# EAGLE design OpenHAS_SensorBoard_v1.0 (EAGLE 7.3.0)
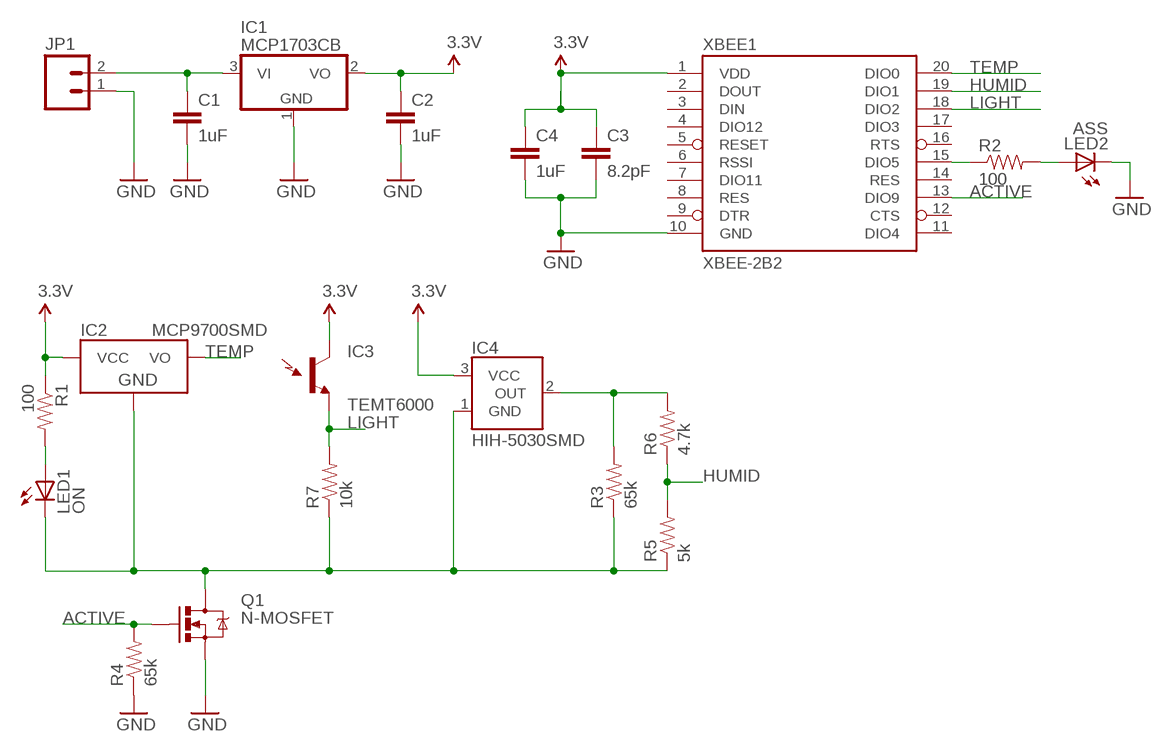
[diagram p0: schematic, sheet 1]

## Parts
C1  1uF  CAP0805  [0805]
C2  1uF  CAP0805  [0805]
C3  8.2pF  CAP0805  [0805]
C4  1uF  CAP0805  [0805]
IC1  MCP1703CB  [SOT23]
IC2  MCP9700SMD  [SOT23-3]
IC3  TEMT6000  LIGHTSENSORTEMT6000  [TEMT6000-SEN]
IC4  HIH-5030SMD  HIH-4030SMD  [HIH-4030]
JP1  M02POLAR  [MOLEX-1X2]
LED1  ON  LEDCHIP-LED0805  [CHIP-LED0805]
LED2  ASS  LEDCHIP-LED0805  [CHIP-LED0805]
Q1  N-MOSFET  MOSFET-NCHANNELAO3404A  [SOT23-3]
R1  100  RESISTOR0805-RES  [0805]
R2  100  RESISTOR0805-RES  [0805]
R3  65k  RESISTOR0805-RES  [0805]
R4  65k  RESISTOR0805-RES  [0805]
R5  5k  RESISTOR0805-RES  [0805]
R6  4.7k  RESISTOR0805-RES  [0805]
R7  10k  RESISTOR0805-RES  [0805]
XBEE1  XBEE-2B2  [XBEE-SILK]

## Nets
3.3V: C2.1 C3.1 C4.1 IC1.2(VO) IC2.1(VCC) IC3.COLLECTOR(C1) IC4.3(VCC) R1.1 XBEE1.1(VDD)
ACTIVE: Q1.1(G) R4.2 XBEE1.13(DIO9)
GND: C1.2 C2.2 C3.2 C4.2 IC1.1(GND) JP1.1 LED2.C Q1.2(S) R4.1 XBEE1.10(GND)
HUMID: R5.2 R6.1 XBEE1.19(DIO1)
LIGHT: IC3.EMITTER(E1) R7.2 XBEE1.18(DIO2)
N$1: R2.1 XBEE1.15(DIO5)
N$2: LED2.A R2.2
N$3: IC4.2(OUT) R3.2 R6.2
N$5: LED1.A R1.2
RAW: C1.1 IC1.3(VI) JP1.2
SW_GND: IC2.3(GND) IC4.1(GND) LED1.C Q1.3(D) R3.1 R5.1 R7.1
TEMP: IC2.2(VO) XBEE1.20(DIO0)
Unconnected: XBEE1.2(DOUT) XBEE1.3(DIN) XBEE1.4(DIO12) XBEE1.5(RESET) XBEE1.6(RSSI) XBEE1.7(DIO11) XBEE1.8(RES) XBEE1.9(DTR) XBEE1.11(DIO4) XBEE1.12(CTS) XBEE1.14(RES) XBEE1.16(RTS) XBEE1.17(DIO3)

## Library data of the parts
C1-C4 = SparkFun-Passives:CAP: Capacitor Standard 0603 ceramic capacitor, and 0.1" leaded capacitor.
IC1 = linear:MCP1703: 250 mA, 16V, Low Quiescent Current LDO Regulator Source: http://ww1.microchip.com/downloads/en/DeviceDoc/22049b.pdf
IC2 = SparkFun-Sensors:MCP9700: Analog-output temperature sensor; PROD_ID: IC-08917
IC3 = SparkFun-Sensors:LIGHTSENSOR: Ambient Light Sensor Simple light detection sensor. Output varies with light intensity input. Spark Fun Electronics SKU : COM-08348
IC4 = SparkFun-Sensors:HIH-4030: Humidity Sensor
JP1 = SparkFun-Connectors:M02: Standard 2-pin 0.1" header. Use with - straight break away headers ( PRT-00116) - right angle break away headers (PRT-00553) - swiss pins (PRT-00743) - machine pins (PRT-00117) - female headers (PRT-00115) Molex polarized connector foot print use with: PRT-08233 with associated crimp pins and housings. 2.54_SCREWTERM for use with PRT-10571. 3.5mm Screw Terminal footprints for PRT-08084 5mm Screw Terminal footprints for use with PRT-08432
LED1 LED2 = led:LED: LED OSRAM: - CHIPLED LG R971, LG N971, LY N971, LG Q971, LY Q971, LO R971, LY R971 LH N974, LH R974 LS Q976, LO Q976, LY Q976 LO Q996 - Hyper CHIPLED LW Q18S LB Q993, LB Q99A, LB R99A - SideLED LS A670, LO A670, LY A670, LG A670, LP A670 LB A673, LV A673, LT A673, LW A673 LH A674 LY A675 LS A676, LA A676, LO A676, LY A676, LW A676 LS A679, LY A679, LG A679 - Hyper Micro SIDELED® LS Y876, LA Y876, LO Y876, LY Y876 LT Y87S - SmartLED LW L88C, LW L88S LB L89C, LB L89S, LG L890 LS L89K, LO L89K, LY L89K LS L896, LA L896, LO L896, LY L896 - TOPLED LS T670, LO T670, LY T670, LG T670, LP T670 LSG T670, LSP T670, LSY T670, LOP T670, LYG T670 LG T671, LOG T671, LSG T671 LB T673, LV T673, LT T673, LW T673 LH T674 LS T676, LA T676, LO T676, LY T676, LB T676, LH T676, LSB T676, LW T676 LB T67C, LV T67C, LT T67C, LS T67K, LO T67K, LY T67K, LW E67C LS E67B, LA E67B, LO E67B, LY E67B, LB E67C, LV E67C, LT E67C LW T67C LS T679, LY T679, LG T679 LS T770, LO T770, LY T770, LG T770, LP T770 LB T773, LV T773, LT T773, LW T773 LH T774 LS E675, LA E675, LY E675, LS T675 LS T776, LA T776, LO T776, LY T776, LB T776 LHGB T686 LT T68C, LB T68C - Hyper Mini TOPLED® LB M676 - Mini TOPLED Santana® LG M470 LS M47K, LO M47K, LY M47K Source: http://www.osram.convergy.de LUXEON: - LUMILED® LXK2-PW12-R00, LXK2-PW12-S00, LXK2-PW14-U00, LXK2-PW14-V00 LXK2-PM12-R00, LXK2-PM12-S00, LXK2-PM14-U00 LXK2-PE12-Q00, LXK2-PE12-R00, LXK2-PE12-S00, LXK2-PE14-T00, LXK2-PE14-U00 LXK2-PB12-K00, LXK2-PB12-L00, LXK2-PB12-M00, LXK2-PB14-N00, LXK2-PB14-P00, LXK2-PB14-Q00 LXK2-PR12-L00, LXK2-PR12-M00, LXK2-PR14-Q00, LXK2-PR14-R00 LXK2-PD12-Q00, LXK2-PD12-R00, LXK2-PD12-S00 LXK2-PH12-R00, LXK2-PH12-S00 LXK2-PL12-P00, LXK2-PL12-Q00, LXK2-PL12-R00 Source: www.luxeon.com KINGBRIGHT: KA-3528ASYC Source: www.kingbright.com
Q1 = SparkFun-DiscreteSemi:MOSFET-NCHANNEL: Common NMOSFET Parts MFG P/N Store ID Prod ID FDD8780 TRANS-09984 SI7820DN TRANS-11055 FDS6630A IC-08089 2N7002PW TRANS-11151 FQP30N06L COM-10213 TRANS-10060 BSS123LT1G TRANS-08345 BSS138 TRANS-00830 BS170 2N7000; PROD_ID: TRAN-12988
R1 = SparkFun-Passives:RESISTOR: Resistor Basic schematic elements and footprints for 0603, 1206, and PTH resistors.
R2-R7 = SparkFun-Resistors:RESISTOR: Resistor Basic schematic elements and footprints for 0603, 1206, and PTH resistors.
XBEE1 = SparkFun-RF:XBEE-2: Xbee module footprints SMT header is CONN-09042.

## Board
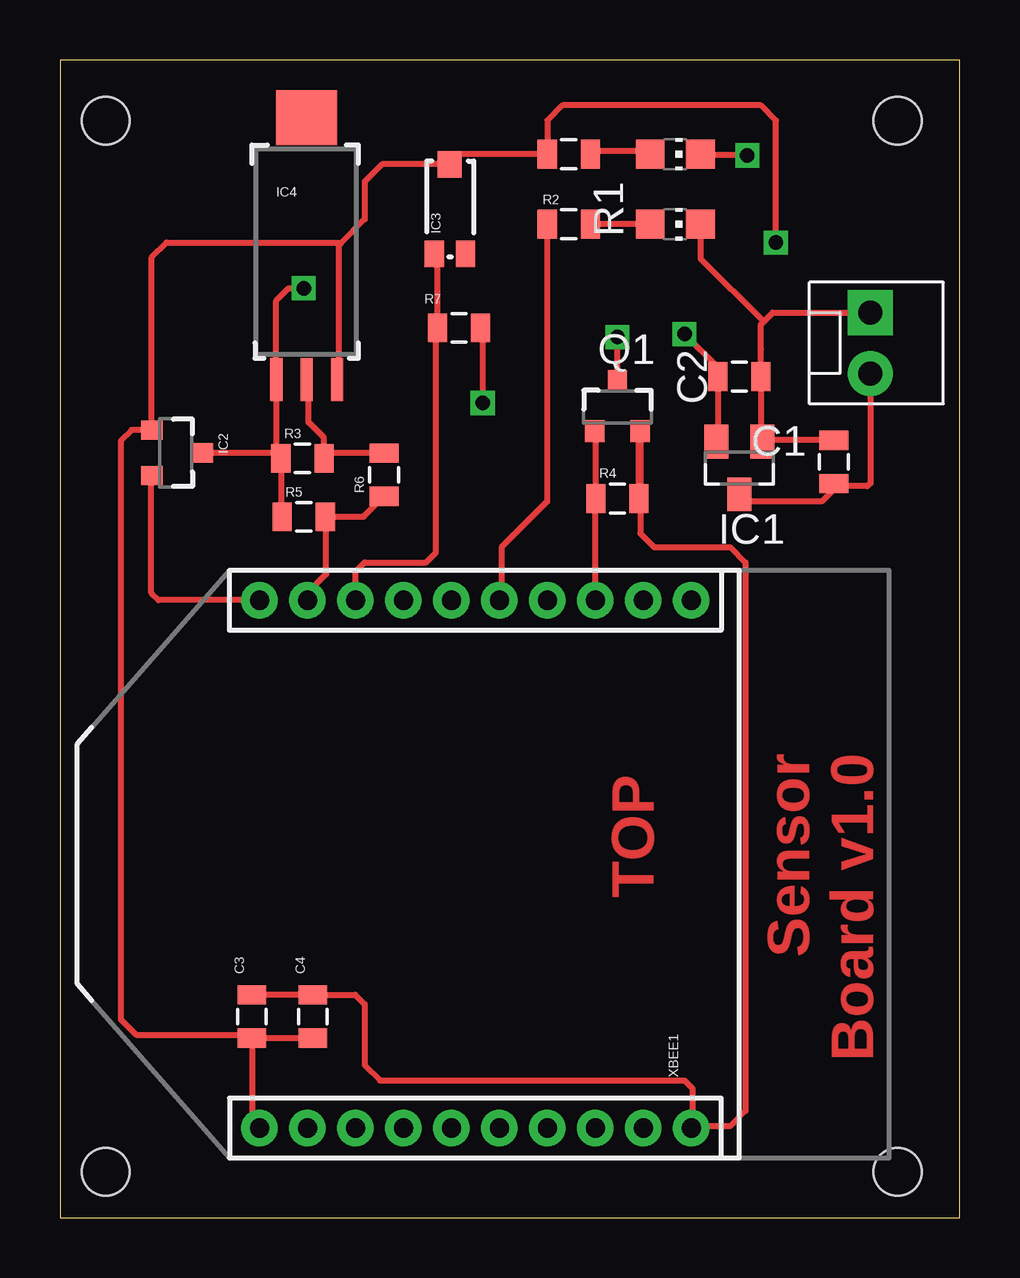
[diagram p1: board, top side]
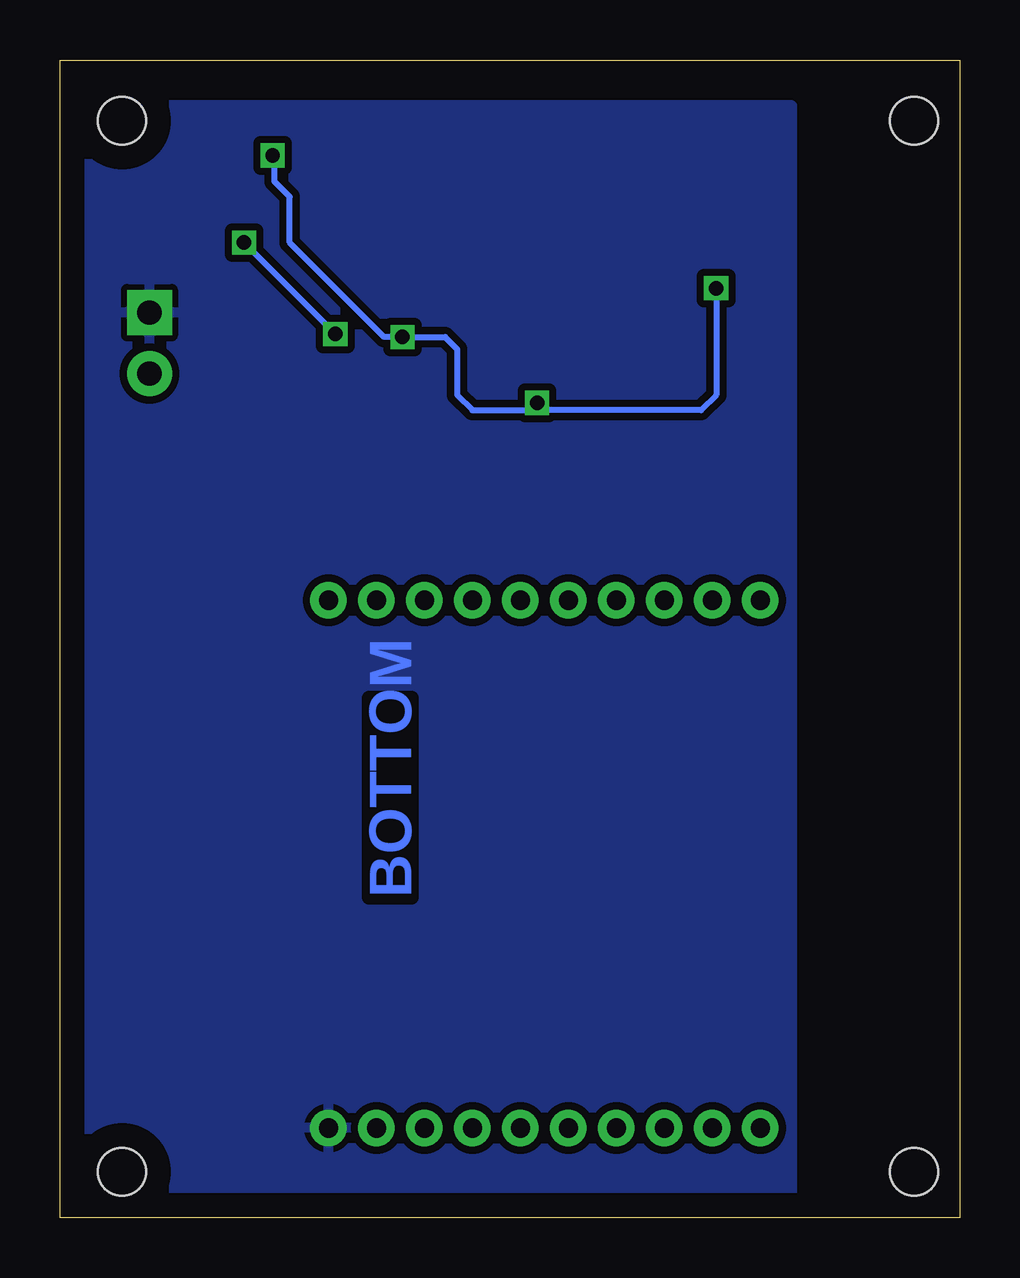
[diagram p2: board, bottom side, seen from below]

Size 37.52 x 48.25 mm. Coordinates in mm from the lower left corner, seen from the top.
Outline: 0,0 37.52,0 37.52,48.25 0,48.25 0,0
Copper layers (1*16): Top 0.035mm / dielectric 1.5mm / Bottom 0.035mm
Design rules "default": minimum track width 10mil, minimum drill 20mil, track to track 8mil, track to pad 8mil, pad to pad 8mil, via to via 8mil, smd to smd 8mil, copper to edge 40mil, drill to drill 8mil, minimum pad ring 10mil, minimum via ring 8mil, stop-mask expansion 4mil, vias tented up to drill 0mil, thermal gap 10mil
Holes 2 mm at 1.91,45.72 34.92,45.72 34.92,1.91 1.91,1.91

### Footprints (pad centres in the part's own frame; a part is rotated, then mirrored left to right if it is on the bottom)
0805 = smd 0.8 x 1.2: 1 -0.9,0; 2 0.9,0
SOT23 = smd 1 x 1.4: 1 -0.95,-1.1; 2 0.95,-1.1; 3 0,1.1
SOT23-3 = smd 0.8 x 0.9: 1 -0.95,-1; 2 0.95,-1; 3 0,1.1
TEMT6000-SEN = smd 1.1 x 0.8: BASE -1.87,-0.65; EMITTER -1.87,0.65 | smd 1.1 x 1: COLLECTOR 1.86,0.01
HIH-4030 = smd 0.508 x 1.778: 1 -1.27,-5.08; 2 0,-5.08; 3 1.27,-5.08 | smd 2.54 x 2.286: NC 0,5.842
MOLEX-1X2 = drill 1.016 pad 1.88 square: 1 0,0 | drill 1.016 pad 1.88: 2 2.54,0
CHIP-LED0805 = smd 1.2 x 1.2: A 0,-1.05; C 0,1.05
XBEE-SILK = drill 0.8 pad 1.524: 1 -11,20; 2 -11,18; 3 -11,16; 4 -11,14; 5 -11,12; 6 -11,10; 7 -11,8; 8 -11,6; 9 -11,4; 10 -11,2; 11 11,2; 12 11,4; 13 11,6; 14 11,8; 15 11,10; 16 11,12; 17 11,14; 18 11,16; 19 11,18; 20 11,20

### Placement (x,y rotation side)
C1  32.26,31.5 90 top
C2  28.32,35.05 0 top
C3  8,8.38 90 top
C4  10.54,8.38 90 top
IC1  28.32,31.24 180 top
IC2  4.83,31.88 270 top
IC3  16.26,42.04 90 top
IC4  10.29,40.01 0 top
JP1  33.78,37.72 270 top
LED1  25.65,44.32 270 top
LED2  25.65,41.4 270 top
Q1  23.24,33.78 0 top
R1  21.21,44.32 0 top
R2  21.21,41.4 0 top
R3  10.11,31.65 0 top
R4  23.24,29.97 180 top
R5  10.16,29.21 0 top
R6  13.51,30.96 90 top
R7  16.64,37.08 180 top
XBEE1  28.32,14.73 90 top

### Tracks (layer width: path | path; a pad name or v marks a point on that pad's centre or on a via)
3.3V  (via drill 0.6)
  Top 0.254: IC1.2 27.42,32.39 C2.1 27.42,35.44 v26.04,36.83 | C3.1 C4.1 | C3.1 8,4.05 XBEE1.1 | 11.73,40.64 12.7,41.6 12.7,43.18 13.42,43.9 IC3.COLLECTOR 16.67,44.32 R1.1 20.32,44.33 20.32,45.72 20.95,46.35 29.21,46.35 29.84,45.72 v29.84,40.64 | 11.73,40.64 11.61,40.51 11.61,34.98 IC4.3 | C3.1 7.86,7.62 3.17,7.62 2.54,8.26 2.54,32.38 2.98,32.83 IC2.1 3.83,40.02 4.45,40.64 11.73,40.64
  Bottom 0.254: v26.04,36.83 v29.84,40.64
ACTIVE
  Top 0.254: XBEE1.13 22.32,29.95 R4.2 22.34,32.73 Q1.1
GND
  Top 0.254: C1.2 29.32,32.4 IC1.1 29.22,32.39 C2.2 29.22,36.18 29.21,36.2 29.21,37.21 29.34,37.34 | 29.34,37.34 29.72,37.72 JP1.1 | C3.2 C4.2 12.31,9.28 12.7,8.89 12.7,6.35 13.34,5.71 26.04,5.71 26.36,5.38 26.36,3.78 XBEE1.10 26.4,3.81 27.94,3.81 28.57,4.45 28.57,27.3 27.94,27.94 24.77,27.94 24.19,28.51 Q1.2 24.14,32.73 R4.1 | LED2.C 26.7,39.97 29.34,37.34
  pour Bottom (isolate 0.305): 6.99,0.64 6.99,46.35 36.83,46.35 36.83,0.64
HUMID
  Top 0.254: XBEE1.19 10.32,26.04 11.1,26.82 11.1,29.17 R5.2 12.66,29.21 R6.1
LIGHT
  Top 0.254: XBEE1.18 12.32,26.93 12.7,27.3 15.27,27.3 15.67,27.71 15.67,37.02 R7.2 15.74,40.04 IC3.EMITTER
N$1
  Top 0.254: R2.1 20.31,29.83 18.41,27.94 18.41,25.83 XBEE1.15
N$2
  Top 0.254: LED2.A R2.2
N$3
  Top 0.254: R6.2 11.22,31.86 R3.2 11.01,32.5 10.36,33.15 10.36,34.85 IC4.2
N$5
  Top 0.254: LED1.A 24.26,44.32 24.13,44.45 22.24,44.45 R1.2
RAW
  Top 0.254: JP1.2 33.78,30.61 33.66,30.48 32.37,30.48 C1.1 32.26,30.35 31.75,29.84 28.62,29.84 IC1.3
SW_GND  (via drill 0.6)
  Top 0.254: Q1.3 v23.24,36.7 | R3.1 9.21,29.26 R5.1 | R3.1 9.02,31.84 IC4.1 9.02,38.23 9.53,38.73 v10.16,38.73 | IC2.3 8.98,31.88 R3.1 | v17.63,33.96 17.63,36.99 R7.1 | v28.65,44.27 26.75,44.27 LED1.C
  Bottom 0.254: v10.16,38.73 10.16,34.29 10.79,33.66 17.32,33.66 v17.63,33.96 17.93,33.66 20.32,33.66 20.95,34.29 20.95,36.2 21.46,36.7 v23.24,36.7 24,36.7 27.94,40.64 27.94,42.55 28.57,43.18 28.57,44.2 v28.65,44.27
TEMP
  Top 0.254: XBEE1.20 4.11,25.73 3.81,26.04 3.81,30.91 IC2.2

### Text on the board
Top: Sensor / Board v1.0 | TOP
Bottom: BOTTOM
tDocu: ON | ASS | + -